# Altium schematic sheet ADJ_REG.SchDoc
size A; SheetNumber: 3; SheetTotal: 4
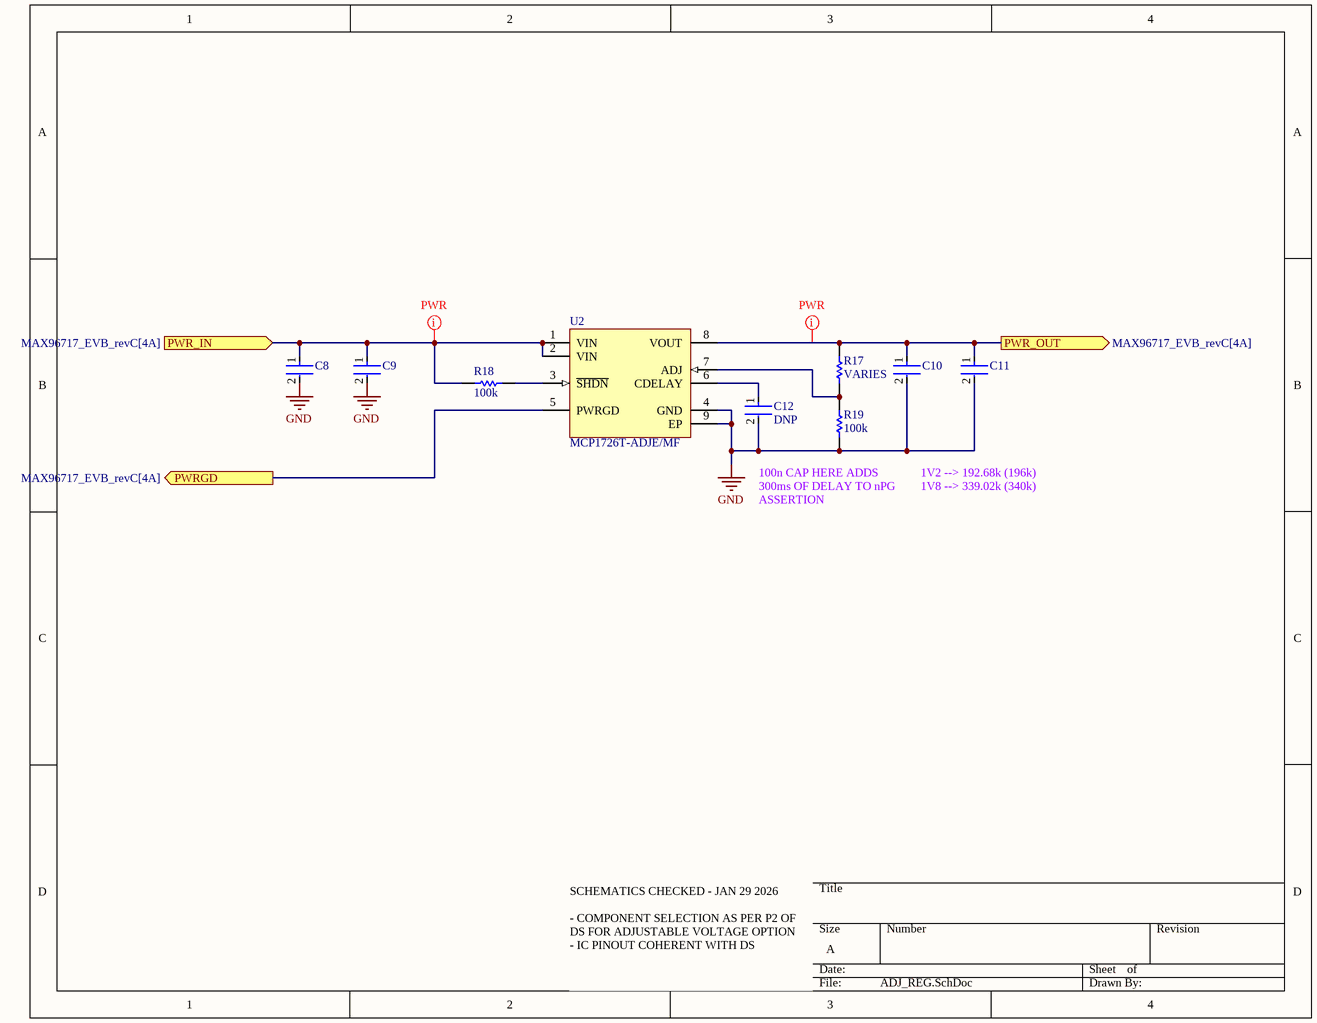
[diagram p0: ADJ_REG.SchDoc]

## Parts
C8  C0805C475J4RACAUTO  [FP-C0805C475J4RACAUTO-MFG]  (value not drawn)
C9  DNP  [FP-C0805C475J4RACAUTO-MFG]  (value not drawn)
C10  HMK325B7105KN-T  [FP-1210-L_3_2_0_3-W_2_5_0-IPC_B]  (value not drawn)
C11  DNP  [FP-1210-L_3_2_0_3-W_2_5_0-IPC_B]  (value not drawn)
C12  DNP  [FP-0402-L_1_0_0_05-W_0_5-IPC_A]
R17  VARIES  [R0603B]
R18  100k  [R0603B]
R19  100k  [R0603B]
U2  MCP1726T-ADJE/MF  [DFN-MF8]

## Ports
PWR_IN (in, see MAX96717_EVB_revC[4A]), PWR_OUT (out, see MAX96717_EVB_revC[4A]), PWRGD (out, see MAX96717_EVB_revC[4A])

## Nets
GND: C8.2 C9.2 C10.2 C11.2 C12.2 R19.1 U2.4(GND) U2.9(EP)
PWR_IN: C8.1 C9.1 R18.1 U2.1(VIN) U2.2(VIN) ; port PWR_IN
PWR_OUT: C10.1 C11.1 R17.2 U2.8(VOUT) ; port PWR_OUT
PWRGD: U2.5(PWRGD) ; port PWRGD
NetC12_1: C12.1 U2.6(CDELAY)
NetR17_1: R17.1 R19.2 U2.7(ADJ)
NetR18_2: R18.2 U2.3(~{SHDN})

## Layout directives
net class PWR: PWR_IN, PWR_OUT

## Notes on the sheet
- (near R19) 100n CAP HERE ADDS 300ms OF DELAY TO nPG ASSERTION
- 1V2 --> 192.68k (196k)
  1V8 --> 339.02k (340k)
- SCHEMATICS CHECKED - JAN 29 2026
  - COMPONENT SELECTION AS PER P2 OF DS FOR ADJUSTABLE VOLTAGE OPTION
  - IC PINOUT COHERENT WITH DS

## Library data of the parts
C8 C9 = CMP-00212-84766729-1: C0805C475J4RACAUTO Cap Ceramic 4.7uF 16V X7R 5% Pad SMD 0805 125C Automotive T/R; Capacitance: 4.7µF; Max Operating Temperature: 125°C; Dielectric Material: Ceramic; Voltage Rating (DC): 16V; Dielectric: X7R; Height: 1.4mm; Case/Package: 0805; NexarPartId: 84766729; Voltage Rating: 16V; RoHS: Compliant; Material: Ceramic; Packaging: Cut Tape; Tolerance: 5%; Min Operating Temperature: -55°C
C10 C11 = CMP-14477-002774-2: None; Dielectric: X5R; Capacitance: 1uF; Voltage Rating (DC): 100V; Tolerance: 10%; Length: 3.2mm; Thickness: 0.083inch; Construction: Flat; Width: 2.5mm; Number of Pins: 2; Height: 1.9mm; REACH SVHC: No SVHC; Case Code (Metric): 3225; Termination: SMD/SMT; Packaging: Tape and Reel; Resistor Type: Ceramic; Mount: Surface Mount; Radiation Hardening: No; Case/Package: 1210; Case Code (Imperial): 1210; Min Operating Temperature: -55°C; Max Operating Temperature: 125°C; Halogen Free: Halogen Free; Voltage Rating: 100V; Depth: 2.5mm; Package Quantity: 1; RoHS Compliant: Yes; Voltage: 100V; Series: M
C12 = CMP-001-00058-1: LARGE PADS, 0402 CAP, CHANGE COMMENT TO MATCH REAL P/N; Capacitor Type: Ceramic; Min Operating Temperature: -55°C; Mounting Technology: Surface Mount; Pins: 2; Case/Package: 0402; RoHS Compliant: Yes; Max Operating Temperature: 85°C
R17-R19 = CMP-009-00002-14: Resistor
  R17: Value: VARIES
  R18 R19: Value: 100k
U2 = CMP-0136-00358-1: 1A, Low Voltage, Low Quiescent Current LDO Regulator, 8-Pin DFN, Extended Temperature, Tape and Reel; DatasheetVersion: revC, Aug-2007; PackageDescription: 8-Lead Plastic Dual Flat, No Lead Package (MF) - 3x3x0.9mm Body [DFN]; PackageVersion: revBB, Aug-2009; PackageReference: DFN-MF8